# EAGLE design prot-atmel-rev8(Display_PowerTip) (EAGLE 6.2)
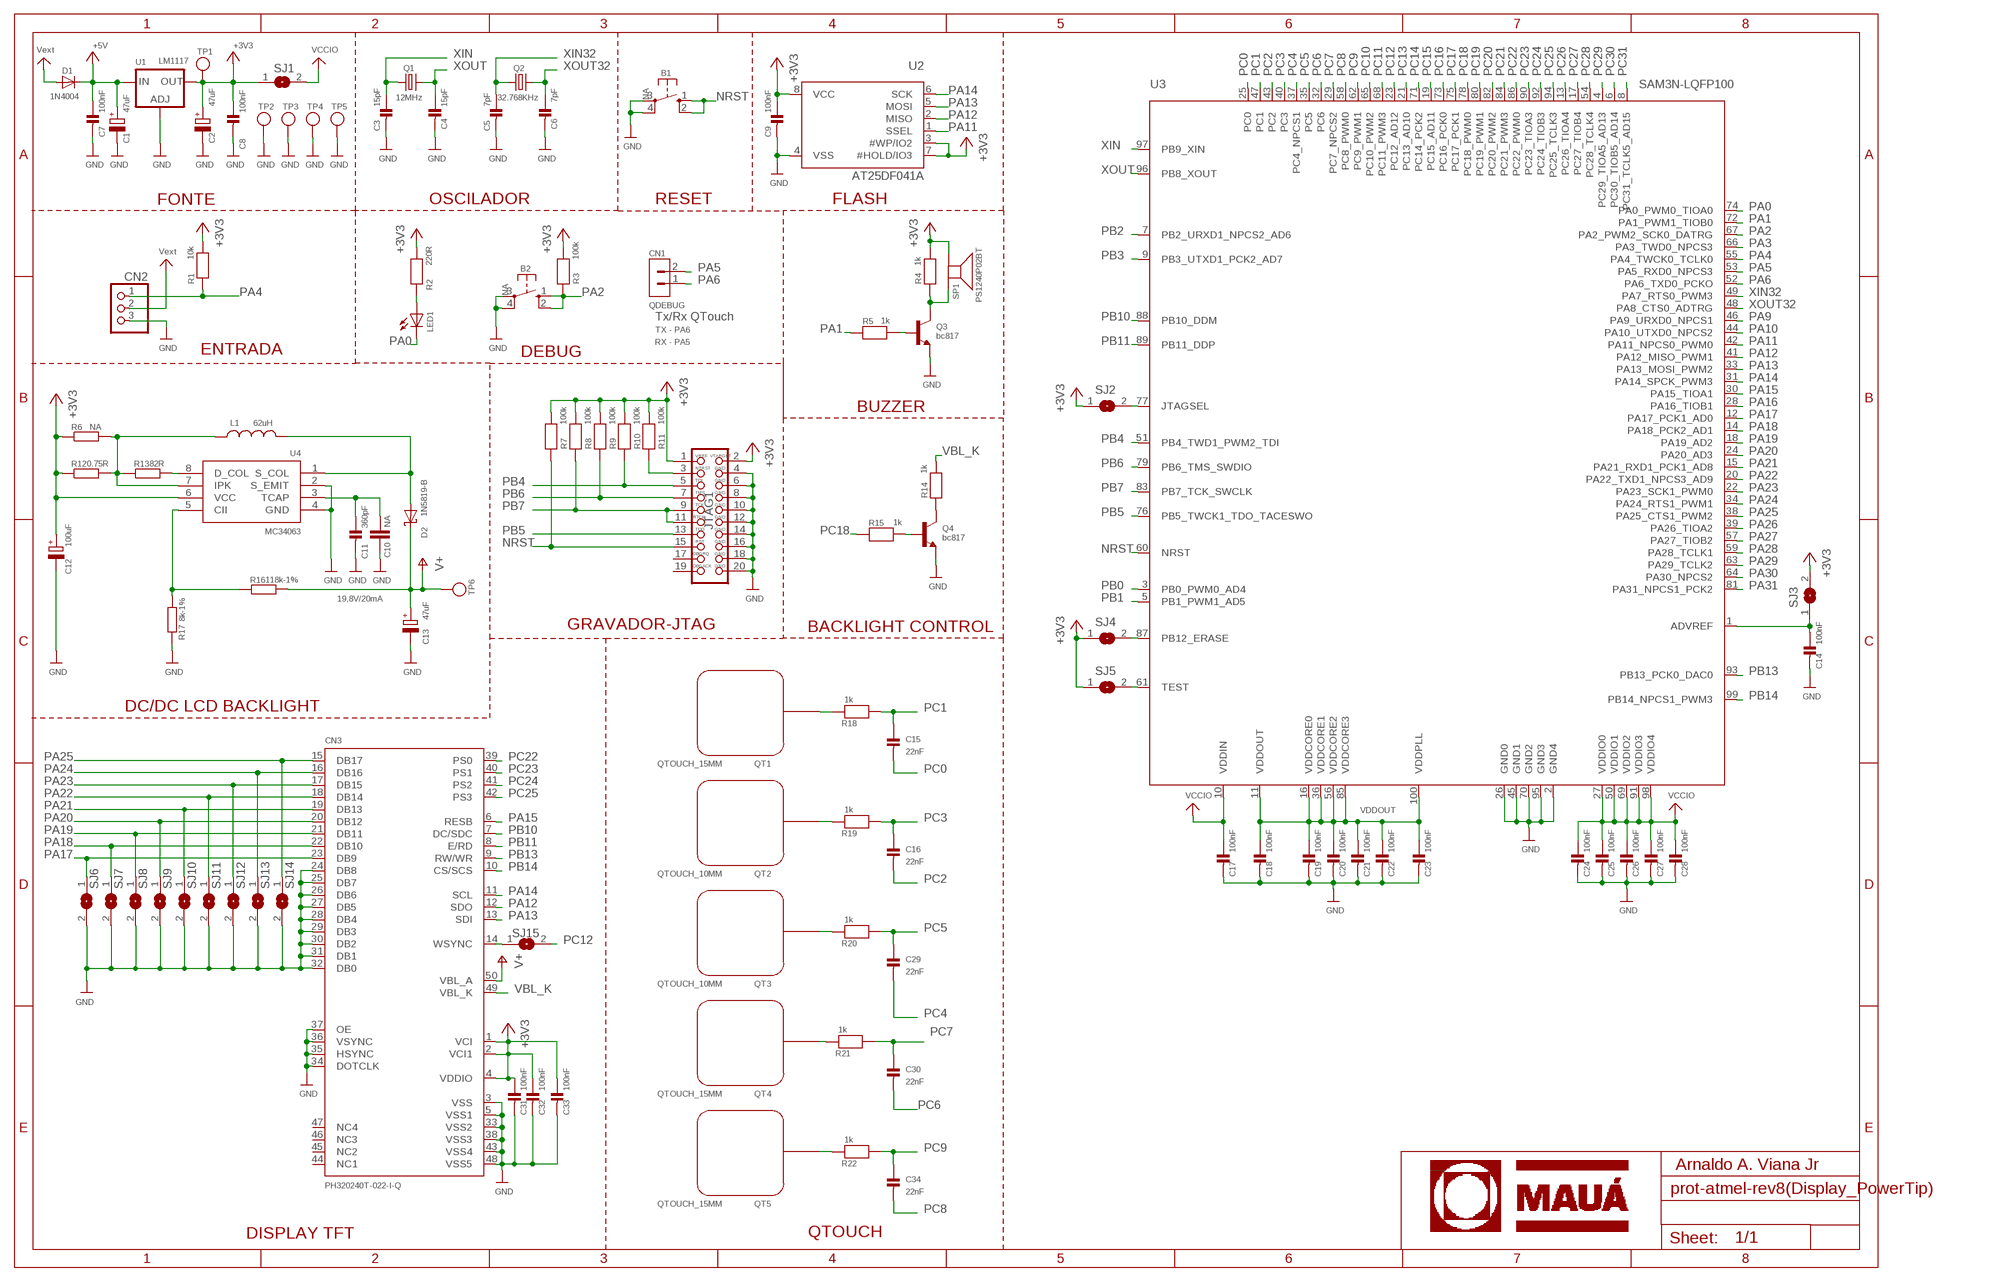
[diagram p0: schematic, sheet 1]

## Parts
B1  NA  10-XX  [B3F-10XX]
B2  NA  10-XX  [B3F-10XX]
C1  47uF  CPOL-EUE2.5-6  [E2,5-6]
C2  47uF  CPOL-EUE2.5-6  [E2,5-6]
C3  15pF  CAP_CERAMIC0805  [0805]
C4  15pF  CAP_CERAMIC0805  [0805]
C5  7pF  CAP_CERAMIC0805  [0805]
C6  7pF  CAP_CERAMIC0805  [0805]
C7  100nF  CAP_CERAMIC0805  [0805]
C8  100nF  CAP_CERAMIC0805  [0805]
C9  100nF  CAP_CERAMIC0805  [0805]
C10  NA  C-EU025-025X050  [C025-025X050]
C11  360pF  CAP_CERAMIC0805  [0805]
C12  100uF  CPOL-EUE2.5-6  [E2,5-6]
C13  47uF  CPOL-EUE2.5-6  [E2,5-6]
C14  100nF  CAP_CERAMIC0805  [0805]
C15  22nF  CAP_CERAMIC0805  [0805]
C16  22nF  CAP_CERAMIC0805  [0805]
C17  100nF  CAP_CERAMIC0805  [0805]
C18  100nF  CAP_CERAMIC0805  [0805]
C19  100nF  CAP_CERAMIC0805  [0805]
C20  100nF  CAP_CERAMIC0805  [0805]
C21  100nF  CAP_CERAMIC0805  [0805]
C22  100nF  CAP_CERAMIC0805  [0805]
C23  100nF  CAP_CERAMIC0805  [0805]
C24  100nF  CAP_CERAMIC0805  [0805]
C25  100nF  CAP_CERAMIC0805  [0805]
C26  100nF  CAP_CERAMIC0805  [0805]
C27  100nF  CAP_CERAMIC0805  [0805]
C28  100nF  CAP_CERAMIC0805  [0805]
C29  22nF  CAP_CERAMIC0805  [0805]
C30  22nF  CAP_CERAMIC0805  [0805]
C31  100nF  CAP_CERAMIC0805  [0805]
C32  100nF  CAP_CERAMIC0805  [0805]
C33  100nF  CAP_CERAMIC0805  [0805]
C34  22nF  CAP_CERAMIC0805  [0805]
CN1  QDEBUG  HEADER_1X02  [HEADER_1X02]
CN2  HEADER-1X3  [1X03_OVAL]
CN3  PH320240T-022-I-Q  DISP_TFT_PH320240T-022-I-QTOP  [FPC50PIN_TFT-PH320240T]
D1  1N4004  DIODE-D-5  [D-5]
D2  1N5819-B  [DO41-7.6]
JTAG1  JTAG-ARM  [JTAG-ARM]
L1  62uH  L-US0204/5  [0204/5]
LED1  LEDSML0805  [SML0805]
Q1  12MHz  CRYSTALHC49S  [HC49/S]
Q2  32.768KHz  CRYSTALTC26V  [TC26V]
Q3  bc817  TRANSISTOR_NPNWAVE  [SOT23-W]
Q4  bc817  TRANSISTOR_NPNWAVE  [SOT23-W]
QT1  QTOUCH_15MM  [BUTTON_15MM]
QT2  QTOUCH_10MM  [BUTTON_10MM]
QT3  QTOUCH_10MM  [BUTTON_10MM]
QT4  QTOUCH_15MM  [BUTTON_15MM]
QT5  QTOUCH_15MM  [BUTTON_15MM]
R1  10k  RESISTOR_0805  [_0805]
R2  220R  RESISTOR_0805  [_0805]
R3  100k  RESISTOR_0805  [_0805]
R4  1k  RESISTOR_0805  [_0805]
R5  1k  RESISTOR_0805  [_0805]
R6  NA  R-EU_0204/5  [0204/5]
R7  100k  RESISTOR_0805  [_0805]
R8  100k  RESISTOR_0805  [_0805]
R9  100k  RESISTOR_0805  [_0805]
R10  100k  RESISTOR_0805  [_0805]
R11  100k  RESISTOR_0805  [_0805]
R12  0.75R  R-EU_R1218  [R1218]
R13  82R  R-EU_M0805  [M0805]
R14  1k  RESISTOR_0805  [_0805]
R15  1k  RESISTOR_0805  [_0805]
R16  118k-1%  R-EU_M0805  [M0805]
R17  8k-1%  R-EU_M0805  [M0805]
R18  1k  RESISTOR_0805  [_0805]
R19  1k  RESISTOR_0805  [_0805]
R20  1k  RESISTOR_0805  [_0805]
R21  1k  RESISTOR_0805  [_0805]
R22  1k  RESISTOR_0805  [_0805]
SJ1  SOLDERJUMPER  [SOLDERJUMPER_ARROW_NOPASTE]
SJ2  SOLDERJUMPER  [SOLDERJUMPER_ARROW_NOPASTE]
SJ3  SOLDERJUMPER  [SOLDERJUMPER_ARROW_NOPASTE]
SJ4  SOLDERJUMPER  [SOLDERJUMPER_ARROW_NOPASTE]
SJ5  SOLDERJUMPER  [SOLDERJUMPER_ARROW_NOPASTE]
SJ6  SOLDERJUMPER  [SOLDERJUMPER_ARROW_NOPASTE]
SJ7  SOLDERJUMPER  [SOLDERJUMPER_ARROW_NOPASTE]
SJ8  SOLDERJUMPER  [SOLDERJUMPER_ARROW_NOPASTE]
SJ9  SOLDERJUMPER  [SOLDERJUMPER_ARROW_NOPASTE]
SJ10  SOLDERJUMPER  [SOLDERJUMPER_ARROW_NOPASTE]
SJ11  SOLDERJUMPER  [SOLDERJUMPER_ARROW_NOPASTE]
SJ12  SOLDERJUMPER  [SOLDERJUMPER_ARROW_NOPASTE]
SJ13  SOLDERJUMPER  [SOLDERJUMPER_ARROW_NOPASTE]
SJ14  SOLDERJUMPER  [SOLDERJUMPER_ARROW_NOPASTE]
SJ15  SOLDERJUMPER  [SOLDERJUMPER_ARROW_NOPASTE]
SP1  PS1240P02BT  [PS1240P02BT]
TP1  +3V3  TESTPOINT0.1"  [1X01_ROUND]
TP2  GND  TESTPOINT0.1"  [1X01_ROUND]
TP3  GND  TESTPOINT0.1"  [1X01_ROUND]
TP4  GND  TESTPOINT0.1"  [1X01_ROUND]
TP5  GND  TESTPOINT0.1"  [1X01_ROUND]
TP6  +V  TESTPOINT0.1"  [1X01_ROUND]
U1  LM1117  LM1117TO252  [TO252]
U2  AT25DF041A  SPIFLASH_SOIC8208MIL  [SOIC8_208MIL]
U3  SAM3N-LQFP100  [LQFP100]
U4  MC34063  MC34063A  [SOIC8_150MIL]

## Nets
12V: CN2.2 D1.A ; supply symbol labelled Vext
+3V3: C2.+ C8.1 C9.1 C12.+ C31.1 C32.1 C33.1 CN3.1(VCI) CN3.2(VCI1) CN3.4(VDDIO) JTAG1.1 JTAG1.2 R1.2 R2.2 R3.2 R4.2 R6.1 R7.2 R8.2 R9.2 R10.2 R11.2 R12.1 SJ1.1 SJ2.1 SJ3.2 SJ4.1 SJ5.1 SP1.P$2 TP1.1 U1.3(OUT) U2.3(#WP/IO2) U2.7(#HOLD/IO3) U2.8(VCC) U4.6(VCC)
+5V: C1.+ C7.1 D1.C U1.2(IN)
ADVREF: C14.1 SJ3.1 U3.1(ADVREF)
GND: B1.3(P) B1.4(P1) B2.3(P) B2.4(P1) C1.- C2.- C3.2 C4.2 C5.2 C6.2 C7.2 C8.2 C9.2 C10.2 C11.2 C12.- C13.- C14.2 C17.2 C18.2 C19.2 C20.2 C21.2 C22.2 C23.2 C24.2 C25.2 C26.2 C27.2 C28.2 C31.2 C32.2 C33.2 CN2.3 CN3.3(VSS) CN3.5(VSS1) CN3.24(DB8) CN3.25(DB7) CN3.26(DB6) CN3.27(DB5) CN3.28(DB4) CN3.29(DB3) CN3.30(DB2) CN3.31(DB1) CN3.32(DB0) CN3.33(VSS2) CN3.34(DOTCLK) CN3.35(HSYNC) CN3.36(VSYNC) CN3.37(OE) CN3.38(VSS3) CN3.43(VSS4) CN3.48(VSS5) JTAG1.4 JTAG1.6 JTAG1.8 JTAG1.10 JTAG1.12 JTAG1.14 JTAG1.16 JTAG1.18 JTAG1.20 Q3.2(E) Q4.2(E) R17.1 SJ6.2 SJ7.2 SJ8.2 SJ9.2 SJ10.2 SJ11.2 SJ12.2 SJ13.2 SJ14.2 TP2.1 TP3.1 TP4.1 TP5.1 U1.1(ADJ) U2.4(VSS) U3.2(GND4) U3.26(GND0) U3.45(GND1) U3.70(GND2) U3.95(GND3) U4.2(S_EMIT) U4.4(GND)
N$1: Q4.1(B) R15.2
N$2: Q4.3(C) R14.1
N$3: SJ2.2 U3.77(JTAGSEL)
N$4: CN3.14(WSYNC) SJ15.1
N$7: JTAG1.3 R11.1
N$8: QT2.P$1 R19.2
N$10: QT3.P$1 R20.2
N$12: QT4.P$1 R21.2
N$14: LED1.A R2.1
N$16: QT5.P$1 R22.2
N$22: SJ4.2 U3.87(PB12_ERASE)
N$26: Q3.1(B) R5.1
N$27: Q3.3(C) R4.1 SP1.P$1
N$30: SJ5.2 U3.61(TEST)
N$49: R13.2 U4.8(D_COL)
N$50: L1.1 R6.2 R12.2 R13.1 U4.7(IPK)
N$51: R16.1 R17.2 U4.5(CII)
N$52: D2.A L1.2 U4.1(S_COL)
N$53: C10.1 C11.1 U4.3(TCAP)
N$59: QT1.P$1 R18.2
NRST: B1.1(S) B1.2(S1) JTAG1.15 R7.1 U3.60(NRST)
PA0: LED1.C U3.74(PA0_PWM0_TIOA0)
PA1: R5.2 U3.72(PA1_PWM1_TIOB0)
PA2: B2.1(S) B2.2(S1) R3.1 U3.67(PA2_PWM2_SCK0_DATRG)
PA3: U3.66(PA3_TWD0_NPCS3)
PA4: CN2.1 R1.1 U3.55(PA4_TWCK0_TCLK0)
PA5: CN1.2 U3.53(PA5_RXD0_NPCS3)
PA6: CN1.1 U3.52(PA6_TXD0_PCKO)
PA9: U3.46(PA9_URXD0_NPCS1)
PA10: U3.44(PA10_UTXD0_NPCS2)
PA11: U2.1(SSEL) U3.42(PA11_NPCS0_PWM0)
PA12: CN3.12(SDO) U2.2(MISO) U3.41(PA12_MISO_PWM1)
PA13: CN3.13(SDI) U2.5(MOSI) U3.33(PA13_MOSI_PWM2)
PA14: CN3.11(SCL) U2.6(SCK) U3.31(PA14_SPCK_PWM3)
PA15: CN3.6(RESB) U3.30(PA15_TIOA1)
PA16: U3.28(PA16_TIOB1)
PA17: CN3.23(DB9) SJ6.1 U3.12(PA17_PCK1_AD0)
PA18: CN3.22(DB10) SJ7.1 U3.14(PA18_PCK2_AD1)
PA19: CN3.21(DB11) SJ8.1 U3.18(PA19_AD2)
PA20: CN3.20(DB12) SJ9.1 U3.24(PA20_AD3)
PA21: CN3.19(DB13) SJ10.1 U3.15(PA21_RXD1_PCK1_AD8)
PA22: CN3.18(DB14) SJ11.1 U3.20(PA22_TXD1_NPCS3_AD9)
PA23: CN3.17(DB15) SJ12.1 U3.22(PA23_SCK1_PWM0)
PA24: CN3.16(DB16) SJ13.1 U3.34(PA24_RTS1_PWM1)
PA25: CN3.15(DB17) SJ14.1 U3.38(PA25_CTS1_PWM2)
PA26: U3.39(PA26_TIOA2)
PA27: U3.57(PA27_TIOB2)
PA28: U3.59(PA28_TCLK1)
PA29: U3.63(PA29_TCLK2)
PA30: U3.64(PA30_NPCS2)
PA31: U3.81(PA31_NPCS1_PCK2)
PB0: U3.3(PB0_PWM0_AD4)
PB1: U3.5(PB1_PWM1_AD5)
PB2: U3.7(PB2_URXD1_NPCS2_AD6)
PB3: U3.9(PB3_UTXD1_PCK2_AD7)
PB4: JTAG1.5 R10.1 U3.51(PB4_TWD1_PWM2_TDI)
PB5: JTAG1.13 U3.76(PB5_TWCK1_TDO_TACESWO)
PB6: JTAG1.7 R9.1 U3.79(PB6_TMS_SWDIO)
PB7: JTAG1.9 JTAG1.11 R8.1 U3.83(PB7_TCK_SWCLK)
PB10: CN3.7(DC/SDC) U3.88(PB10_DDM)
PB11: CN3.8(E/RD) U3.89(PB11_DDP)
PB13: CN3.9(RW/WR) U3.93(PB13_PCK0_DAC0)
PB14: CN3.10(CS/SCS) U3.99(PB14_NPCS1_PWM3)
PC0: C15.2 U3.25(PC0)
PC1: C15.1 R18.1 U3.47(PC1)
PC2: C16.2 U3.43(PC2)
PC3: C16.1 R19.1 U3.40(PC3)
PC4: C29.2 U3.37(PC4_NPCS1)
PC5: C29.1 R20.1 U3.35(PC5)
PC6: C30.2 U3.32(PC6)
PC7: C30.1 R21.1 U3.29(PC7_NPCS2)
PC8: C34.2 U3.58(PC8_PWM0)
PC9: C34.1 R22.1 U3.62(PC9_PWM1)
PC10: U3.65(PC10_PWM2)
PC11: U3.68(PC11_PWM3)
PC12: SJ15.2 U3.23(PC12_AD12)
PC13: U3.21(PC13_AD10)
PC14: U3.71(PC14_PCK2)
PC15: U3.19(PC15_AD11)
PC16: U3.73(PC16_PCK0)
PC17: U3.75(PC17_PCK1)
PC18: R15.1 U3.78(PC18_PWM0)
PC19: U3.80(PC19_PWM1)
PC20: U3.82(PC20_PWM2)
PC21: U3.84(PC21_PWM3)
PC22: CN3.39(PS0) U3.86(PC22_PWM0)
PC23: CN3.40(PS1) U3.90(PC23_TIOA3)
PC24: CN3.41(PS2) U3.92(PC24_TIOB3)
PC25: CN3.42(PS3) U3.94(PC25_TCLK3)
PC26: U3.13(PC26_TIOA4)
PC27: U3.17(PC27_TIOB4)
PC28: U3.54(PC28_TCLK4)
PC29: U3.4(PC29_TIOA5_AD13)
PC30: U3.6(PC30_TIOB5_AD14)
PC31: U3.8(PC31_TCLK5_AD15)
V+: C13.+ CN3.50(VBL_A) D2.C R16.2 TP6.1
VBL_K: CN3.49(VBL_K) R14.2
VCCIO: C17.1 C24.1 C25.1 C26.1 C27.1 C28.1 SJ1.2 U3.10(VDDIN) U3.27(VDDIO0) U3.50(VDDIO1) U3.69(VDDIO2) U3.91(VDDIO3) U3.98(VDDIO4)
VDDOUT: C18.1 C19.1 C20.1 C21.1 C22.1 C23.1 U3.11(VDDOUT) U3.16(VDDCORE0) U3.36(VDDCORE1) U3.56(VDDCORE2) U3.85(VDDCORE3) U3.100(VDDPLL)
XIN: C3.1 Q1.1 U3.97(PB9_XIN)
XIN32: C5.1 Q2.1 U3.49(PA7_RTS0_PWM3)
XOUT: C4.1 Q1.2 U3.96(PB8_XOUT)
XOUT32: C6.1 Q2.2 U3.48(PA8_CTS0_ADTRG)
Unconnected: CN3.44(NC1) CN3.45(NC2) CN3.46(NC3) CN3.47(NC4) JTAG1.17 JTAG1.19

## Notes on the sheet
- FONTE | OSCILADOR | RESET | FLASH
- Tx/Rx QTouch
- TX - PA6
- RX - PA5
- ENTRADA | DEBUG
- BUZZER
- 19,8V/20mA
- GRAVADOR-JTAG | BACKLIGHT CONTROL
- DC/DC LCD BACKLIGHT
- Arnaldo A. Viana Jr
- DISPLAY TFT | QTOUCH

## Library data of the parts
B1 B2 = switch-omron:10-XX: OMRON SWITCH; EAGLEUP: B3F-10xx; MPN: B3F-1000; OC_FARNELL: 176432; OC_NEWARK: 36M3542
C1 C2 C12 C13 = rcl:CPOL-EU: POLARIZED CAPACITOR, European symbol; EAGLEUP: E5-6
C3-C9 C11 C14-C34 = junior:CAP_CERAMIC: Ceramic Capacitors 0402 - 0402 Surface Mount Capacitors 16pF 50V 5% [Digikey: 445-4899-2-ND] 18pF 50V 5% [Digikey: 490-1281-2-ND] 22pF 50V 5% [Digikey: 490-1283-2-ND] 68pF 50V 5% [Digikey: 490-1289-2-ND] 0.1uF 10V 10% [Digikey: 490-1318-2-ND] 1.0uF 6.3V 10% [Digikey: 490-1320-2-ND] 0603 - 0603 Surface Mount Capacitors 16 pF 50V 5% [Digikey: 445-5051-2-ND] 22 pF 50V [Digikey: PCC220ACVTR-ND] 33 pF 50V 5% [Digikey: 490-1415-1-ND] 56pF 50V 5% [Digikey: 490-1421-1-ND] 220pF 50V 5% [Digikey: 445-1285-1-ND] 680 pF 50V 2200 pF 50V 5% C0G [Digikey: 445-1297-1-ND] 5600 pF 100V 5% X7R [Digikey: 478-3711-1-ND] 0.1 µF 25V 10% [Digikey: PCC2277TR-ND] 0.22 µF 16V 10% X7R [Digikey: 445-1318-1-ND] 1.0 µF 25V 10% [Digikey: 445-5146-2-ND] 0603 - RF Specific 3pF 250V +/-0.1pF RF [Digikey: 712-1347-1-ND] 18 pF 250V 5% [Digikey: 478-3505-1-ND or 712-1322-1-ND] 56 pF 250V 5% C0G RF [Digikey: 490-4867-1-ND] 68 pF 250V RF [Digikey: 490-4868-1-ND] 0805 - 0805 Surface Mount Capacitors 220 pF 250V 2% RF Ceramic Capacitor [Digikey: 712-1398-1-ND] 1000 pF 50V 2% NP0 Ceramic Capacitor [Digikey: 478-3760-1-ND] 0.1 µF 25V 10% Ceramic Capacitor [Digikey: PCC1828TR-ND] 1.0 µF 16V 10% Ceramic Capacitor[Digikey: 490-1691-2-ND] 10.0 µF 10V 10% Ceramic Capacitor[Digikey: 709-1228-1-ND] 10.0 uF 16V 10% Ceramic Capacitor [Digikey: 478-5165-2-ND] 47 uF 6.3V 20% Ceramic Capacitor [Digikey: 587-1779-1-ND or 399-5506-1-ND] 1206 - 1206 Surface Mount Capacitors 47uF 10V 20% Ceramic Capacitor [Digikey: 490-5528-1-ND or 399-5508-1-ND or 445-6010-1-ND] 100uF 6.3V -20%, +80% Y5V Ceramic Capacitor (Digikey: 490-4512-1-ND, Mouser: 81-GRM31CF50J107ZE1L); EAGLEUP: C0805
C10 = rcl:C-EU: CAPACITOR, European symbol
CN1 = junior:HEADER_1X02: 2-Pin 0,254cm / 0.1" Header
CN2 = junior:HEADER-1X3: PIN HEADER
CN3 = junior:DISP_TFT_PH320240T-022-I-Q: DISPLAY TFT 320X240 POWERTIP PH320240T-022-I-Q Power Supply Voltage: 3v3 Backlight: 19,8V/20mA
D1 = diode:DIODE-: DIODE; EAGLEUP: DO41-10
D2 = diode:1N581*: 1.0A SCHOTTKY BARRIER RECTIFIER Source: http://www.diodes.com/datasheets/ds23001.pdf; EAGLEUP: DO41-10
JTAG1 = junior:JTAG-ARM: 20 Pin JTAG Connector For use with ARM7, and ARM9. Supported by some Cortex M3 boards with SWJ-DP interfaces (dual SWP/JTAG support). 4UConnector: 03556; EAGLEUP: ML20
L1 = rcl:L-US: INDUCTOR, American symbol
LED1 = led:LED: LED OSRAM: - CHIPLED LG R971, LG N971, LY N971, LG Q971, LY Q971, LO R971, LY R971 LH N974, LH R974 LS Q976, LO Q976, LY Q976 LO Q996 - Hyper CHIPLED LW Q18S LB Q993, LB Q99A, LB R99A - SideLED LS A670, LO A670, LY A670, LG A670, LP A670 LB A673, LV A673, LT A673, LW A673 LH A674 LY A675 LS A676, LA A676, LO A676, LY A676, LW A676 LS A679, LY A679, LG A679 - Hyper Micro SIDELED® LS Y876, LA Y876, LO Y876, LY Y876 LT Y87S - SmartLED LW L88C, LW L88S LB L89C, LB L89S, LG L890 LS L89K, LO L89K, LY L89K LS L896, LA L896, LO L896, LY L896 - TOPLED LS T670, LO T670, LY T670, LG T670, LP T670 LSG T670, LSP T670, LSY T670, LOP T670, LYG T670 LG T671, LOG T671, LSG T671 LB T673, LV T673, LT T673, LW T673 LH T674 LS T676, LA T676, LO T676, LY T676, LB T676, LH T676, LSB T676, LW T676 LB T67C, LV T67C, LT T67C, LS T67K, LO T67K, LY T67K, LW E67C LS E67B, LA E67B, LO E67B, LY E67B, LB E67C, LV E67C, LT E67C LW T67C LS T679, LY T679, LG T679 LS T770, LO T770, LY T770, LG T770, LP T770 LB T773, LV T773, LT T773, LW T773 LH T774 LS E675, LA E675, LY E675, LS T675 LS T776, LA T776, LO T776, LY T776, LB T776 LHGB T686 LT T68C, LB T68C - Hyper Mini TOPLED® LB M676 - Mini TOPLED Santana® LG M470 LS M47K, LO M47K, LY M47K Source: http://www.osram.convergy.de LUXEON: - LUMILED® LXK2-PW12-R00, LXK2-PW12-S00, LXK2-PW14-U00, LXK2-PW14-V00 LXK2-PM12-R00, LXK2-PM12-S00, LXK2-PM14-U00 LXK2-PE12-Q00, LXK2-PE12-R00, LXK2-PE12-S00, LXK2-PE14-T00, LXK2-PE14-U00 LXK2-PB12-K00, LXK2-PB12-L00, LXK2-PB12-M00, LXK2-PB14-N00, LXK2-PB14-P00, LXK2-PB14-Q00 LXK2-PR12-L00, LXK2-PR12-M00, LXK2-PR14-Q00, LXK2-PR14-R00 LXK2-PD12-Q00, LXK2-PD12-R00, LXK2-PD12-S00 LXK2-PH12-R00, LXK2-PH12-S00 LXK2-PL12-P00, LXK2-PL12-Q00, LXK2-PL12-R00 Source: www.luxeon.com KINGBRIGHT: KA-3528ASYC Source: www.kingbright.com
Q1 = crystal:CRYSTAL: CRYSTAL; EAGLEUP: HC49U70; OC_FARNELL: 1667008; OC_NEWARK: unknown
Q2 = crystal:CRYSTAL: CRYSTAL; EAGLEUP: TC38H; OC_FARNELL: unknown; OC_NEWARK: unknown
Q3 Q4 = junior:TRANSISTOR_NPN: NPN Transistor Transistor (NPN) 500mA 45V - BC817 [Digikey: 568-1631-1-ND] Transistor (NPN) 500mA 45V - BC817,215 [Mouser: 771-BC817-T/R] SOT23-R - SOT23 footprint optimised for use with solder paste and reflow ovens. SOT23-W - SOT23 footprint optimised for hand-soldering (larger pads).; EAGLEUP: SOT23
QT1 QT4 QT5 = QTOUCH:QTOUCH_15MM
QT2 QT3 = QTOUCH:QTOUCH_10MM
R1-R5 R7-R11 R14 R15 R18-R22 = junior:RESISTOR: Resistors 0402 - 0402 Surface Mount Package 22 Ohm 1% 1/16W [Digikey: 311-22.0LRTR-ND] 33 Ohm 5% 1/16W 1.0K 5% 1/16W 1.5K 5% 1/16W 2.0K 1% 1/16W 10.0K 1% 1/16W [Digikey: 311-10.0KLRTR-ND] 10.0K 5% 1/16W [Digikey: RMCF0402JT10K0TR-ND] 12.1K 1% 1/16W [Digikey: 311-22.0LRTR-ND] 100.0K 5% 1/16W 0603 - 0603 Surface Mount Package 0 Ohm 1/10 Watt 1% Resistor 15 Ohm 1/10 Watt 1% Resistor 33 Ohm 1/10 Watt 1% Resistor 49.9 Ohm 1/10 Watt 1% Resistor 100 Ohm 1/10 Watt 1% Resistor 150 Ohm 1/10 Watt 1% Resistor 240 Ohm 1/10 Watt 1% Resistor 390 Ohm 1/10 Watt 1% Resistor 560 Ohm 1/10 Watt 1% Resistor 680 Ohm 1/10 Watt 1% Resistor 750 Ohm 1/10 Watt 1% Resistor 1.0K Ohm 1/10 Watt 1% Resistor 1.5K Ohm 1/10 Watt 1% Resistor 2.0K Ohm 1/10 Watt 1% Resistor 2.2K Ohm 1/10 Watt 1% Resistor 3.3K Ohm 1/10 Watt 1% Resistor 4.7K Ohm 1/10 Watt 1% Resistor 10.0K Ohm 1/10 Watt 1% Resistor 12.0K Ohm 1/10 Watt 1% Resistor 12.1K Ohm 1/10 Watt 1% Resistor 20.0K Ohm 1/10 Watt 1% Resistor 33.0K Ohm 1/10 Watt 1% Resistor 100.0K Ohm 1/10 Watt 1% Resistor 0805 - 0805 Surface Mount Package 0 Ohm 1/8 Watt 1% Resistor 33 Ohm 1/8 Watt 1% Resistor 100 Ohm 1/8 Watt 1% Resistor 150 Ohm 1/8 Watt 1% Resistor 200 Ohm 1/8 Watt 1% Resistor 240 Ohm 1/8 Watt 1% Resistor 330 Ohm 1/8 Watt 1% Resistor 390 Ohm 1/8 Watt 1% Resistor 470 Ohm 1/8 Watt 1% Resistor 1.0K Ohm 1/8 Watt 1% Resistor 1.5K Ohm 1/8 Watt 1% Resistor 2.0K Ohm 1/8 Watt 1% Resistor 4.7K Ohm 1/8 Watt 1% Resistor 5.1K Ohm 1/8 Watt 1% Resistor 5.6K Ohm 1/8 Watt 1% Resistor 10.0K Ohm 1/8 Watt 1% Resistor 22.0K Ohm 1/8 Watt 1% Resistor 33.0K Ohm 1/8 Watt 1% Resistor 100K Ohm 1/8 Watt 1% Resistor 1206 - 1206 Surface Mount Package 2012 - 2010 Surface Mount Package 0.11 Ohm 1/2 Watt 1% Resistor - Digikey: RHM.11UCT-ND; EAGLEUP: R0805
R6 = rcl:R-EU_: RESISTOR, European symbol
R12 = rcl:R-EU_: RESISTOR, European symbol; EAGLEUP: R1206
R13 R16 R17 = rcl:R-EU_: RESISTOR, European symbol; EAGLEUP: R0805
SJ1-SJ15 = junior:SOLDERJUMPER: SMD Solder JUMPER Solder the two pads together to create a connection, or remove the solder to break it. REFLOW - Use this footprint for solder paste and reflow ovens. WAVE - Use this footprint for hand-soldering (larger pads). CLOSED - Has a trace between the two pads to ensure it is closed by default. The trace needs to be cut to disable the jumper, and can be closed again by creating a solder bridge between the two pads.; BOM: EXCLUDE
SP1 = junior:PS1240P02BT; EAGLEUP: buzzer
TP1-TP6 = junior:TESTPOINT: Test Point Various test points for characterisation and PCB testing TESTPOINT_SMT - Compact Surface Mount Test Point [Digikey: 5016KTR-ND]; BOM: EXCLUDE
U1 = junior:LM1117: LM1117 Voltage Regulator LM1117 Adjustable Voltage regulator [Digikey: LM1117IMP-ADJDKR-ND] LM1117 3.3V Voltage regulator [AP1117E33GDIDKR-ND] LM1117 5.0V Voltage regulator [AP1117E50GDIDKR-ND] SOT223-REFLOW - SOT223 package for solder paste/reflow ovens SOT223-WAVE - SOT223 package for hand-soldering (larger pads) Note: For the fixed-voltage regulators, simply set the ADJ pin to GND.
U2 = junior:SPIFLASH_SOIC8: SOIC8 SPI Flash Be careful with the size since SOIC8 flash comes in several 'widths' SOIC8 150 mil M25P16 - 16Mbit (2Mbit x 8) Serial Flash (75MHz SPI Bus), Supply: 2.7-3.6V Digikey: SOIC8 - M25P16-VMN6P-ND SOIC8 208 mil W25Q16BVSSIG - 16Mbit (2Mbit x 8) Serial Flash (104MHz SPI Bus), Supply: 2.7-3.6V Digikey: SOIC8 - W25Q16BVSSIG-ND
U3 = junior:SAM3N-LQFP100: Atmel ARM Cortex-M3
U4 = microbuilder:MC34063A: MC34063A - 1.5A 3V-40V Boost/Buck/Inverting Voltage Regulator [Part No.] Allows you to 'boost', reduce or invert the voltage of your power supply to a more appropriate level. Common voltage regulators like the LM1117 are easy to use, but they can only 'reduce' the voltage level and require more volts than they provide, making them useless for low voltage power supplies like batteries or solar panels. A 'Step-Up' regulator like the MC34063A solves this problem by also allowing you to increase the voltage to a pre-determined level, though you still need to pay attention to the minimum voltage level the converter can handle, keeping in mind that many 'step-up' converts are less efficient at the two extreme ends of their working range. Given that many step-up circuits introduce some ripple to the power supply, you can often get a much 'smoother' supply by boosting the voltage up to 5.0V and then using a standard fixed voltage regulator (such as the common LM1117, etc.) to drop the voltage back down to 3.3V. This may not be necessary, and some step up regulators can provide a smooth supply on their own, but it's worth keeping in mind if you do encounter some ripple in the power supply using only a step-up IC for your power supply. Texas Instruments MC34063A Digikey: 296-17765-1-ND; EAGLEUP: SO08

## Board
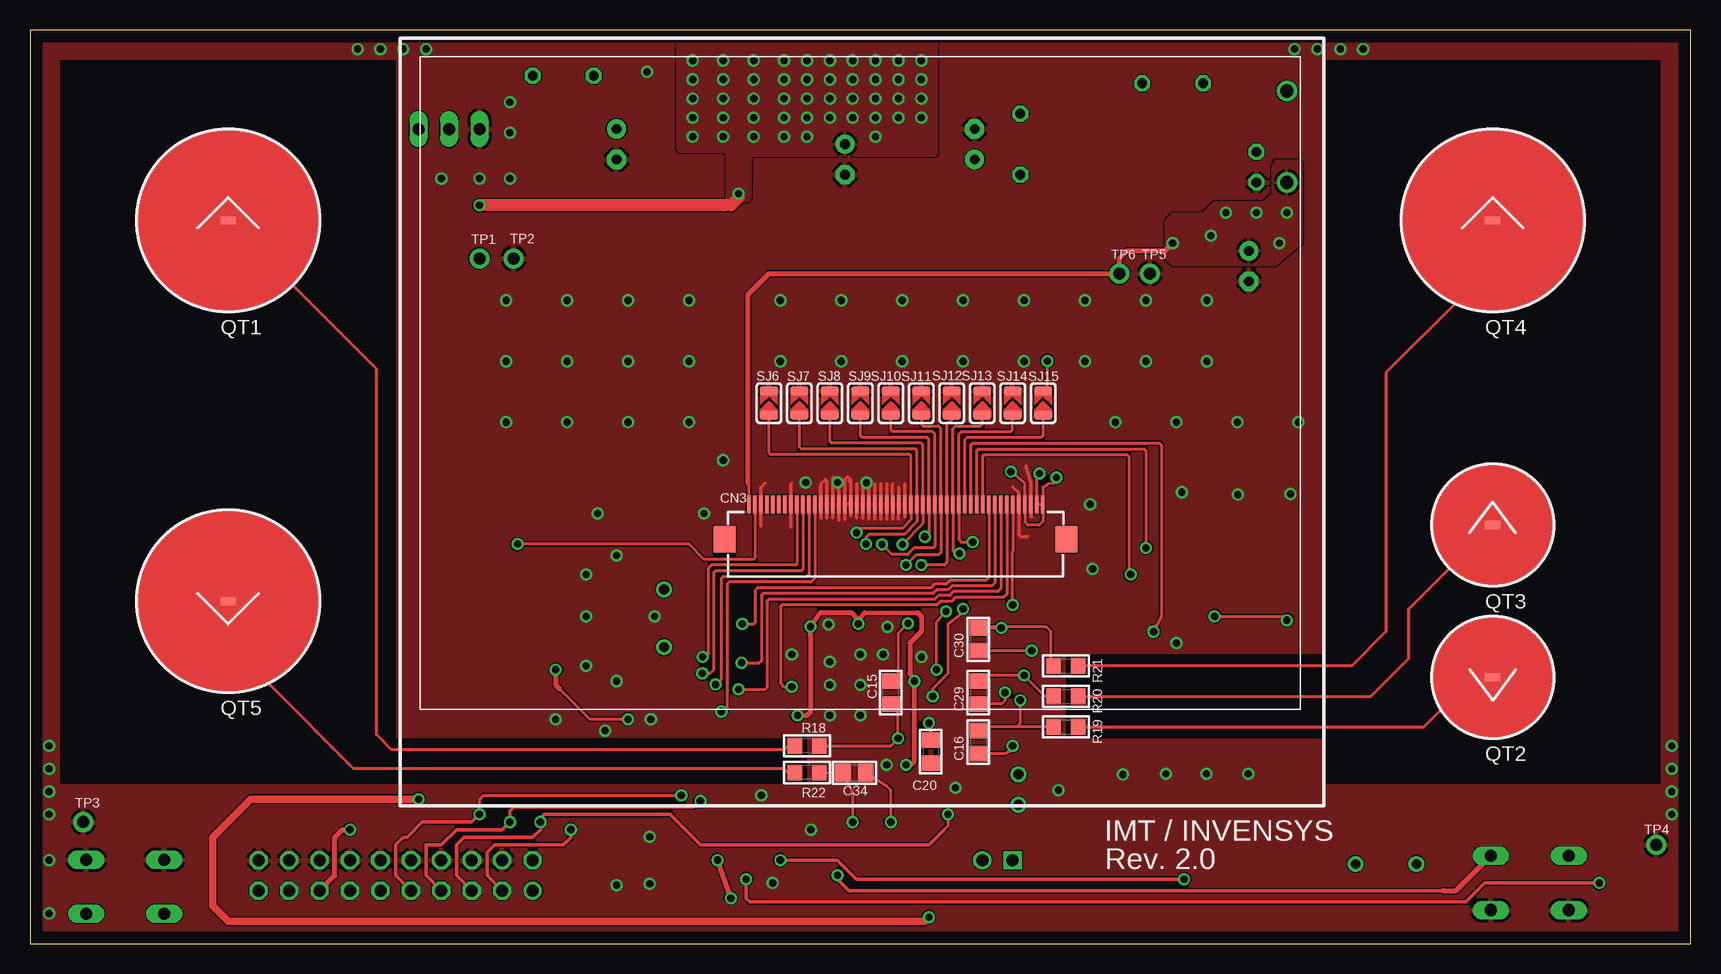
[diagram p1: board, top side]
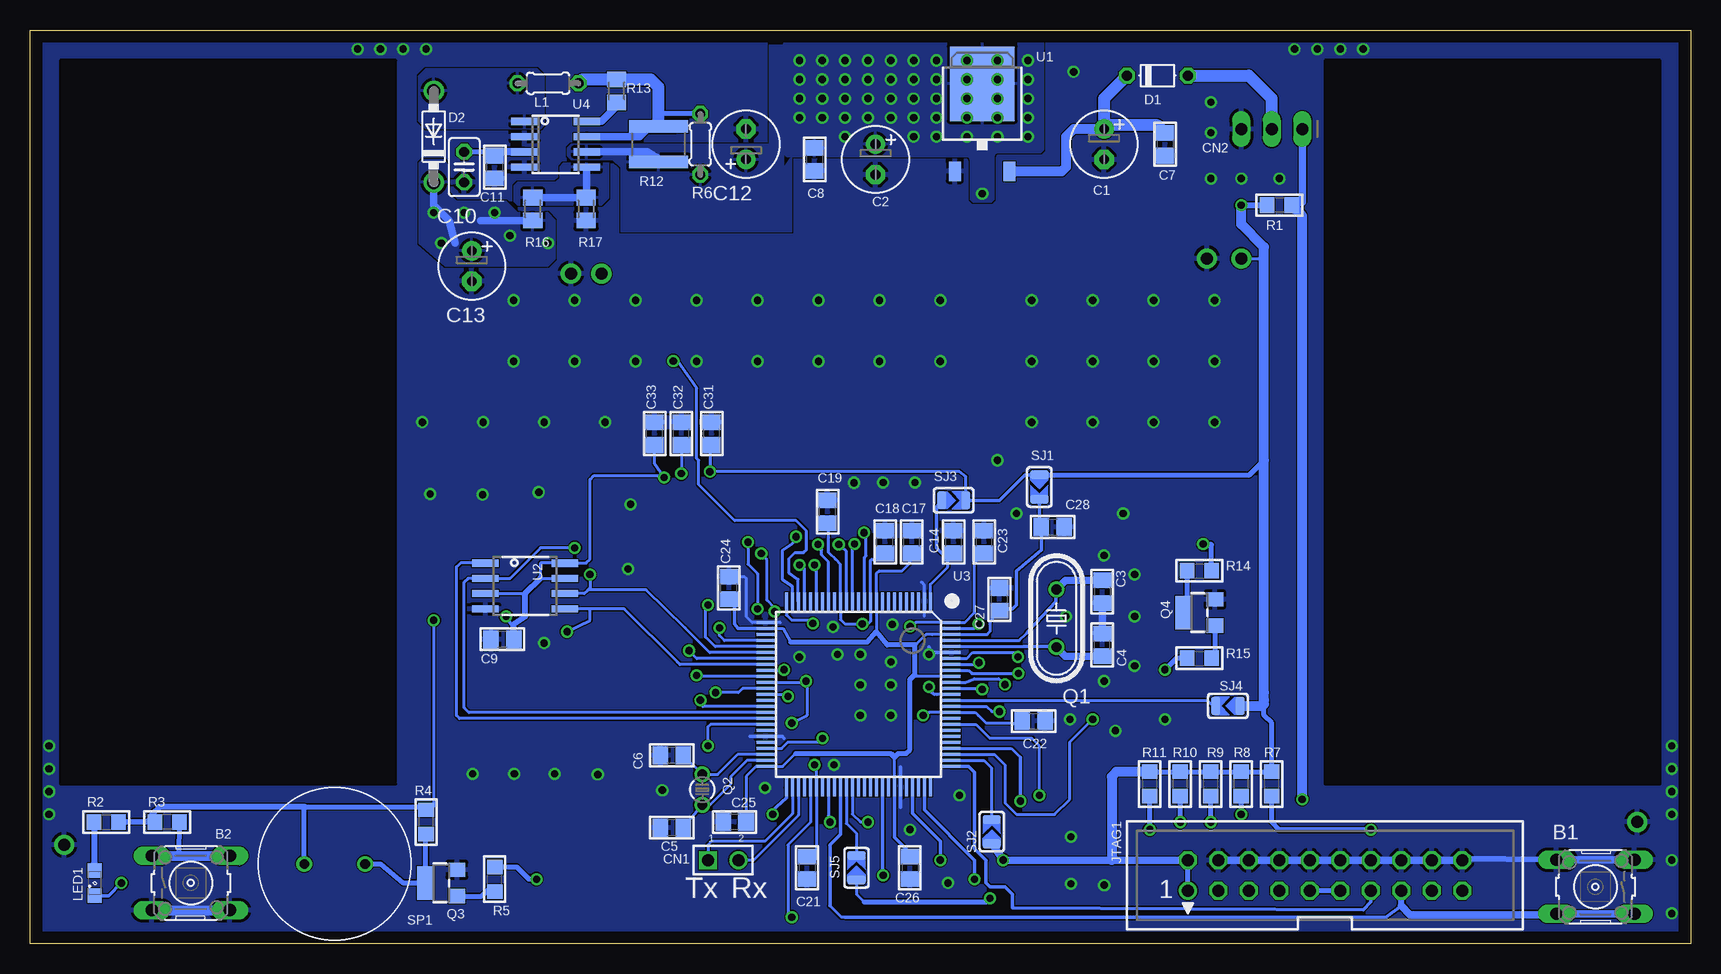
[diagram p2: board, bottom side, seen from below]

Size 138.43 x 76.2 mm. Coordinates in mm from the lower left corner, seen from the top.
Outline: 0,0 138.43,0 138.43,76.2 0,76.2 0,0
Copper layers (1*16): Top 0.035mm / dielectric 1.5mm / Bottom 0.035mm
Design rules: minimum track width 10mil, minimum drill 24mil, track to track 4mil, track to pad 8mil, pad to pad 8mil, via to via 8mil, smd to smd 8mil, copper to edge 40mil, drill to drill 8mil, minimum pad ring 10mil, minimum via ring 8mil, stop-mask expansion 4mil, vias tented up to drill 0mil, thermal gap 10mil

### Footprints (pad centres in the part's own frame; a part is rotated, then mirrored left to right if it is on the bottom)
B3F-10XX = drill 1.016 long: 1 -3.251,2.261; 2 3.251,2.261; 3 -3.251,-2.261; 4 3.251,-2.261
E2,5-6 = drill 0.813 pad 1.6: + -1.27,0 | drill 0.813 pad 1.6 octagon: - 1.27,0
0805 = smd 1.3 x 1.5: 1 -0.95,0; 2 0.95,0
C025-025X050 = drill 0.813 octagon: 1 -1.27,0; 2 1.27,0
HEADER_1X02 = drill 1 square: 1 0,0 | drill 1: 2 2.54,0
1X03_OVAL = drill 1 long: 1 -2.54,0; 2 0,0; 3 2.54,0
FPC50PIN_TFT-PH320240T = smd 0.275 x 1.5: 1 15.211,-6.846; 2 14.711,-6.846; 3 14.211,-6.846; 4 13.711,-6.846; 5 13.211,-6.846; 6 12.711,-6.846; 7 12.211,-6.846; 8 11.711,-6.846; 9 11.211,-6.846; 10 10.711,-6.846; 11 10.211,-6.846; 12 9.711,-6.846; 13 9.211,-6.846; 14 8.711,-6.846; 15 8.211,-6.846; 16 7.711,-6.846; 17 7.211,-6.846; 18 6.711,-6.846; 19 6.211,-6.846; 20 5.711,-6.846; 21 5.211,-6.846; 22 4.711,-6.846; 23 4.211,-6.846; 24 3.711,-6.846; 25 3.211,-6.846; 26 2.711,-6.846; 27 2.211,-6.846; 28 1.711,-6.846; 29 1.211,-6.846; 30 0.711,-6.846; 31 0.211,-6.846; 32 -0.289,-6.846; 33 -0.789,-6.846; 34 -1.289,-6.846; 35 -1.789,-6.846; 36 -2.289,-6.846; 37 -2.789,-6.846; 38 -3.289,-6.846; 39 -3.789,-6.846; 40 -4.289,-6.846; 41 -4.789,-6.846; 42 -5.289,-6.846; 43 -5.789,-6.846; 44 -6.289,-6.846; 45 -6.789,-6.846; 46 -7.289,-6.846; 47 -7.789,-6.846; 48 -8.289,-6.846; 49 -8.789,-6.846; 50 -9.289,-6.846 | smd 1.8 x 2.2: SUPPORT1 -11.319,-9.766; SUPPORT2 17.181,-9.766
D-5 = drill 0.813 octagon: A 2.54,0; C -2.54,0
DO41-7.6 = drill 1.1 pad 1.7: A 3.81,0; C -3.81,0
JTAG-ARM = drill 1: 1 -11.43,-1.27 | drill 1 octagon: 2 -11.43,1.27; 3 -8.89,-1.27; 4 -8.89,1.27; 5 -6.35,-1.27; 6 -6.35,1.27; 7 -3.81,-1.27; 8 -3.81,1.27; 9 -1.27,-1.27; 10 -1.27,1.27; 11 1.27,-1.27; 12 1.27,1.27; 13 3.81,-1.27; 14 3.81,1.27; 15 6.35,-1.27; 16 6.35,1.27; 17 8.89,-1.27; 18 8.89,1.27; 19 11.43,-1.27; 20 11.43,1.27
0204/5 = drill 0.813 octagon: 1 -2.54,0; 2 2.54,0
SML0805 = smd 1.2 x 1.2: A 1.05,0; C -1.05,0
HC49/S = drill 0.813: 1 -2.413,0; 2 2.413,0
TC26V = drill 0.813: 1 -1.27,0; 2 1.27,0
SOT23-W = smd 1.2 x 1.4: 1 -1.1,-1.3; 2 1.1,-1.3 | smd 2.8 x 1.4: 3 0,1.3
BUTTON_15MM = smd 1.27 x 0.635: P$1 0,0
BUTTON_10MM = smd 1.27 x 0.635: P$1 0,0
_0805 = smd 1.2 x 1.3: 1 -1.016,0; 2 1.016,0
R1218 = smd 1.05 x 4.9: 1 -1.475,0; 2 1.475,0
M0805 = smd 1.3 x 1.6: 1 -0.95,0; 2 0.95,0
SOLDERJUMPER_ARROW_NOPASTE = smd 0.762 x 1.524: 1 -1.016,0; 2 1.016,0
PS1240P02BT = drill 0.8: P$1 -2.54,0; P$2 2.54,0
1X01_ROUND = drill 1 pad 1.676: 1 0,0
TO252 = smd 1 x 1.6: 1 -2.28,-4.8; 2 2.28,-4.8 | smd 5.4 x 6.2: 3 0,2.5
SOIC8_208MIL = smd 0.6 x 2.2: 1 -1.905,-3.315; 2 -0.635,-3.315; 3 0.635,-3.315; 4 1.905,-3.315; 5 1.905,3.315; 6 0.635,3.315; 7 -0.635,3.315; 8 -1.905,3.315
LQFP100 = smd 0.27 x 1.5: 1 -6,-7.75; 2 -5.5,-7.75; 3 -5,-7.75; 4 -4.5,-7.75; 5 -4,-7.75; 6 -3.5,-7.75; 7 -3,-7.75; 8 -2.5,-7.75; 9 -2,-7.75; 10 -1.5,-7.75; 11 -1,-7.75; 12 -0.5,-7.75; 13 0,-7.75; 14 0.5,-7.75; 15 1,-7.75; 16 1.5,-7.75; 17 2,-7.75; 18 2.5,-7.75; 19 3,-7.75; 20 3.5,-7.75; 21 4,-7.75; 22 4.5,-7.75; 23 5,-7.75; 24 5.5,-7.75; 25 6,-7.75; 51 6,7.75; 52 5.5,7.75; 53 5,7.75; 54 4.5,7.75; 55 4,7.75; 56 3.5,7.75; 57 3,7.75; 58 2.5,7.75; 59 2,7.75; 60 1.5,7.75; 61 1,7.75; 62 0.5,7.75; 63 0,7.75; 64 -0.5,7.75; 65 -1,7.75; 66 -1.5,7.75; 67 -2,7.75; 68 -2.5,7.75; 69 -3,7.75; 70 -3.5,7.75; 71 -4,7.75; 72 -4.5,7.75; 73 -5,7.75; 74 -5.5,7.75; 75 -6,7.75 | smd 1.5 x 0.27: 26 7.75,-6; 27 7.75,-5.5; 28 7.75,-5; 29 7.75,-4.5; 30 7.75,-4; 31 7.75,-3.5; 32 7.75,-3; 33 7.75,-2.5; 34 7.75,-2; 35 7.75,-1.5; 36 7.75,-1; 37 7.75,-0.5; 38 7.75,0; 39 7.75,0.5; 40 7.75,1; 41 7.75,1.5; 42 7.75,2; 43 7.75,2.5; 44 7.75,3; 45 7.75,3.5; 46 7.75,4; 47 7.75,4.5; 48 7.75,5; 49 7.75,5.5; 50 7.75,6; 76 -7.75,6; 77 -7.75,5.5; 78 -7.75,5; 79 -7.75,4.5; 80 -7.75,4; 81 -7.75,3.5; 82 -7.75,3; 83 -7.75,2.5; 84 -7.75,2; 85 -7.75,1.5; 86 -7.75,1; 87 -7.75,0.5; 88 -7.75,0; 89 -7.75,-0.5; 90 -7.75,-1; 91 -7.75,-1.5; 92 -7.75,-2; 93 -7.75,-2.5; 94 -7.75,-3; 95 -7.75,-3.5; 96 -7.75,-4; 97 -7.75,-4.5; 98 -7.75,-5; 99 -7.75,-5.5; 100 -7.75,-6
SOIC8_150MIL = smd 0.6 x 2.2: 1 -1.905,-2.6; 2 -0.635,-2.6; 3 0.635,-2.6; 4 1.905,-2.6; 5 1.905,2.6; 6 0.635,2.6; 7 -0.635,2.6; 8 -1.905,2.6

### Placement (x,y rotation side)
B1  7.94,4.76 180 bottom
B2  125.02,5.08 0 bottom
C1  48.9,66.67 270 bottom
C2  67.94,65.41 270 bottom
C3  49.05,29.37 270 bottom
C4  49.05,24.93 90 bottom
C5  84.93,9.69 180 bottom
C6  84.93,15.72 180 bottom
C7  43.81,66.67 270 bottom
C8  73.03,65.41 270 bottom
C9  99.06,25.4 180 bottom
C10  102.23,64.77 270 bottom
C11  99.69,64.77 270 bottom
C12  78.74,66.67 90 bottom
C13  101.6,56.52 270 bottom
C14  61.43,33.5 90 bottom
C15  71.75,20.95 90 top
C16  79.06,16.83 270 top
C17  64.92,33.5 90 bottom
C18  67.15,33.5 90 bottom
C19  71.94,36.04 90 bottom
C20  75.08,16.04 270 top
C21  73.66,6.35 270 bottom
C22  54.76,18.58 0 bottom
C23  58.89,33.5 90 bottom
C24  80.16,29.68 90 bottom
C25  79.69,10.16 180 bottom
C26  65.09,6.35 270 bottom
C27  57.62,28.73 90 bottom
C28  53.19,34.76 0 bottom
C29  79.06,20.95 270 top
C30  79.06,25.4 270 top
C31  81.6,42.55 90 bottom
C32  84.14,42.55 90 bottom
C33  86.36,42.55 90 bottom
C34  68.72,14.26 0 top
CN1  81.92,6.99 0 bottom
CN2  34.92,67.94 180 bottom
CN3  69.22,43.5 0 top
D1  44.45,72.39 0 bottom
D2  104.78,67.31 90 bottom
JTAG1  30.48,5.71 0 bottom
L1  95.25,71.75 180 bottom
LED1  133.03,5.08 90 bottom
Q1  52.86,27.15 270 bottom
Q2  82.39,12.86 90 bottom
Q3  104.14,5.08 90 bottom
Q4  40.96,27.62 90 bottom
QT1  16.51,60.33 0 top
QT2  121.92,22.23 180 top
QT3  121.92,34.92 0 top
QT4  121.92,60.33 0 top
QT5  16.51,28.57 180 top
R1  34.29,61.59 180 bottom
R2  132.08,10.16 0 bottom
R3  127,10.16 180 bottom
R4  105.41,10.16 90 bottom
R5  99.69,5.4 90 bottom
R6  82.55,66.67 90 bottom
R7  34.92,13.34 90 bottom
R8  37.47,13.34 90 bottom
R9  40.01,13.34 90 bottom
R10  42.55,13.34 90 bottom
R11  45.09,13.34 90 bottom
R12  86.04,66.67 90 bottom
R13  89.53,71.12 270 bottom
R14  40.96,31.11 0 bottom
R15  40.96,23.81 0 bottom
R16  96.52,61.27 270 bottom
R17  92.08,61.27 90 bottom
R18  64.77,16.51 180 top
R19  86.36,18.1 0 top
R20  86.36,20.64 0 top
R21  86.36,23.18 0 top
R22  64.77,14.29 180 top
SJ1  54.29,38.1 270 bottom
SJ2  58.26,9.36 90 bottom
SJ3  61.43,36.98 0 bottom
SJ4  38.57,19.85 180 bottom
SJ5  69.53,6.35 90 bottom
SJ6  61.59,45.09 90 top
SJ7  64.14,45.09 90 top
SJ8  66.67,45.09 90 top
SJ9  69.22,45.09 90 top
SJ10  71.75,45.09 90 top
SJ11  74.3,45.09 90 top
SJ12  76.83,45.09 90 top
SJ13  79.38,45.09 90 top
SJ14  81.92,45.09 90 top
SJ15  84.45,45.09 90 top
SP1  113.03,6.67 180 bottom
TP1  37.47,57.15 0 top
TP2  40.32,57.15 0 top
TP3  4.45,10.16 0 top
TP4  135.57,8.26 0 top
TP5  93.34,55.88 0 top
TP6  90.81,55.88 0 top
U1  59.05,69.22 0 bottom
U2  97.16,29.84 270 bottom
U3  69.37,20.8 180 bottom
U4  94.61,66.67 270 bottom
U$9  [LOGO_MAUA]  116.2,41.59 0 top
U$13  [LOGO_MAUA]  21.91,40.96 0 bottom

### Tracks (layer width: path | path; a pad name or v marks a point on that pad's centre or on a via)
12V
  Bottom 1.016: CN2.2 34.92,70.48 36.83,72.39 D1.A
+3V3  (via drill 0.6)
  Top 0.254: 57.78,61.59 57.78,61.27 | v98.74,27.3 104.46,27.3 v104.78,26.99 | CN3.1 CN3.2 83.93,38.95 v84.14,39.21 | CN3.1 84.43,35.21 84.14,34.92 83.19,34.92 82.93,35.18 CN3.4 82.93,37.28 82.93,38.39 v81.76,39.37 | v85.57,38.89 85.57,38.58 85.32,38.38 84.87,38.36 84.43,38.07 CN3.1
  Top 0.305: 57.2,61.55 58.06,61.32 57.78,61.59
  Top 0.406: v58.42,3.81 v57.31,6.99
  Top 1.016: v59.05,62.55 59.05,62.23 58.42,61.59 57.78,61.59 v37.47,61.59
  Bottom 0.254: SJ5.1 69.53,4.13 68.9,3.49 | TP1.1 35.56,57.15 35.56,20.95 | U2.3 97.16,29.21 | U2.7 95.89,30.48 95.89,31.75 U2.8 92.08,31.75 91.76,32.07 91.76,38.73 91.44,39.05 85.72,39.05 v85.57,38.89 86.36,40.01 C33.1 | 98.11,26.35 v98.74,27.3 | v104.78,26.99 104.78,11.43 105.16,11.43 R4.2 | C32.1 v84.14,39.21 | C31.1 81.6,41.27 81.76,41.12 v81.76,39.37 60.96,39.37 60.42,38.98 SJ3.2
  Bottom 0.305: SJ1.1 55.5,39.12 57.63,36.98 SJ3.2
  Bottom 0.406: JTAG1.1 JTAG1.2 | R11.2 R10.2 R9.2 R8.2 R7.2 34.92,18.41 35.56,19.05 35.56,20.32 | SP1.P$2 115.57,11.43 105.66,11.43 R4.2 | 68.9,3.49 58.74,3.49 v58.42,3.81 | SJ1.1 36.77,39.12 35.56,40.32
  Bottom 0.508: v37.47,61.59 R1.2 | 95.89,30.48 97.16,29.21 97.16,27.3 98.11,26.67 98.11,26.35 C9.1 | R2.2 130.49,10.16 128.59,10.22 R3.2 128.27,10.79 127.64,11.43 115.57,11.43
  Bottom 0.61: U4.6 87,66.04 85.86,65.41 R12.1 | SJ2.1 v57.3,6.98 v57.31,6.99 48.26,6.99 JTAG1.2
  Bottom 0.813: SJ4.1 35.72,19.85 35.56,20 35.56,20.32 35.56,20.95 35.56,40.32 35.56,58.1 37.47,60.01 v37.47,61.59 | R11.2 47.88,14.35 48.26,13.97 48.26,6.99
  Bottom 1.016: 59.05,71.75 U1.3
  other vias: 55.24,73.66 55.24,72.07 55.24,70.48 55.24,68.9 55.24,67.31 62.87,73.66 62.87,72.07 62.87,70.48 62.87,68.9 62.87,67.31 64.77,73.66 64.77,72.07 64.77,70.48 64.77,68.9 64.77,67.31 66.67,73.66 66.67,72.07 66.67,70.48 66.67,68.9 68.58,73.66 68.58,72.07 68.58,70.48 68.58,68.9 70.48,73.66 70.48,72.07 70.48,70.48 70.48,68.9 70.48,67.31 72.39,73.66 72.39,72.07 72.39,70.48 72.39,68.9 74.3,73.66 74.3,72.07 74.3,70.48 74.3,68.9 60.33,73.66 60.33,72.07 60.33,70.48 60.33,68.9 60.33,67.31 57.78,73.66 57.78,72.07 57.78,70.48 57.78,68.9 57.78,67.31
  pour Bottom: 57.78,66.04 54.29,66.04 arc-90 53.98,66.36 53.98,74.93 arc-90 54.29,75.25 75.25,75.25 arc-90 75.56,74.93 75.56,66.04 arc-90 75.25,65.72 60.33,65.72 arc90 60.01,65.41 60.01,62.23 arc-90 59.69,61.91 58.42,61.91 arc-90 58.1,62.23 58.1,65.72 arc90
  pour Bottom: 57.78,66.04 54.29,66.04 arc-90 53.98,66.36 53.98,74.93 arc-90 54.29,75.25 75.25,75.25 arc-90 75.56,74.93 75.56,66.04 arc-90 75.25,65.72 60.33,65.72 arc90 60.01,65.41 60.01,62.23 arc-90 59.69,61.91 58.42,61.91 arc-90 58.1,62.23 58.1,65.72 arc90
  pour Top: 57.78,66.04 54.29,66.04 arc-90 53.98,66.36 53.98,74.93 arc-90 54.29,75.25 75.25,75.25 arc-90 75.56,74.93 75.56,66.04 arc-90 75.25,65.72 60.33,65.72 arc90 60.01,65.41 60.01,62.23 arc-90 59.69,61.91 58.42,61.91 arc-90 58.1,62.23 58.1,65.72 arc90
  pour Bottom (isolate 0.254): 76.83,66.67 93.34,66.67 93.66,66.36 93.66,65.72 93.34,65.41 89.85,65.41 89.22,64.77 89.22,59.37 74.93,59.37 74.93,65.72 75.56,64.77 75.56,74.93 76.83,74.93
+5V
  Bottom 0.813: U1.2 52.42,64.42 52.07,64.77 52.07,67.31 51.44,67.94 C1.+
  Bottom 1.016: D1.C 48.9,70.48 C1.+ 48.69,68.26 44.45,68.26 C7.1
ADVREF
  Bottom 0.254: U3.1 63.37,29.98 61.91,31.43 61.91,32.4 C14.1
  Bottom 0.305: C14.1 62.4,32.55 62.87,33.02 62.87,36.45 SJ3.1
GND  (via drill 0.6)
  Top 0.254: 63.5,38.42 63.43,38.34 CN3.43 63.43,34.72 | CN3.48 60.93,38.07 61.28,38.42 | CN3.25 72.43,38.06 | CN3.35 67.43,38.52 67,38.94 66.93,38.86 CN3.36 66.93,36.67 | CN3.34 67.93,36.75 | 67.93,36.75 67.93,38.6 67.92,38.61 67.92,38.73 68.15,38.96 68.43,38.69 CN3.33 | 69.93,37.26 69.93,38.35 | 70.43,37.26 70.43,38.35 | 70.92,37.26 70.92,38.35 | 71.42,37.26 71.42,38.35 | 68.94,37.29 68.94,38.38 | 71.91,37.26 71.91,38.35 | 72.92,37.26 72.92,38.35 | 69.42,37.36 69.44,37.39 69.44,38.58 | 67.92,37.36 67.92,38.56 | 67.44,37.01 67.44,38.2 | 66.93,37.01 66.93,38.2 | 66.42,37.03 66.42,38.23 | 65.91,37.01 65.91,38.2 | 68.26,38.58 68.42,38.42 68.42,36.67 68,36.67 67.93,36.75 | 60.93,34.82 60.93,36.24 | 67.93,35.38 CN3.34 | 68.43,35.69 CN3.33 | CN3.33 68.43,36.83 | 69.93,35.41 69.93,36.5 | 70.43,35.41 70.43,36.5 | 70.92,35.41 70.92,36.5 | 71.42,35.41 71.42,36.5 | 68.91,35.53 68.91,36.52 68.93,36.54 CN3.32 | 69.42,35.51 69.44,35.53 69.44,36.73 69.43,36.71 CN3.31 | 67.92,35.51 CN3.34 | 68.45,36.07 68.42,36.56 CN3.33 | 67.44,35.33 67.44,36.52 | 66.93,35.53 66.93,36.67 | 66.93,36.67 66.93,36.73 | 66.42,35.51 66.42,36.7 66.43,36.7 CN3.37 66.43,38.6 66.29,38.73 65.93,38.37 CN3.38 65.94,36.66 | 65.94,35.48 65.94,36.66 | 71.93,35.41 71.93,36.5 | 72.42,35.41 72.42,36.5 | 72.92,35.59 72.92,36.45 72.93,36.45 CN3.24 | 67.92,36.7 CN3.34 | CN3.34 | 65.94,36.68 65.94,36.66 | 81.92,38.1 82.43,37.59 CN3.5 82.43,34.1 82.55,33.97 83.19,33.97 | 83.03,39.85 83.43,38.49 CN3.3 83.43,35.64 83.5,35.56
  Bottom 0.254: U3.26 78.24,26.8 78.74,27.3 78.74,30.48 78.89,30.63 C24.2 | 64.14,30.16 63.87,29.9 63.87,28.68 U3.2 63.87,27.33 | 75.88,26.8 77,26.8
  Bottom 0.305: U3.70 65.87,14.78 | U3.95 63.33,24.3 63.5,24.77 | 75.56,17.14 75.72,17.3 U3.45 78.39,17.3 | 65.86,11.38 65.86,13.11
  Bottom 0.508: B1.4 19.59,7.08 JTAG1.20
  Bottom 0.61: JTAG1.20 JTAG1.18 JTAG1.16 JTAG1.14 JTAG1.12 JTAG1.10 JTAG1.8 JTAG1.6 JTAG1.4 | B1.3 B1.4 | C4.2 C3.2
  Bottom 0.813: B2.3 B2.4
  other vias: 105.41,74.61 107.31,74.61 111.12,74.61 109.22,74.61 27.3,74.61 29.21,74.61 31.11,74.61 33.02,74.61 1.59,10.79 1.59,12.7 1.59,14.61 1.59,16.51 136.84,10.79 136.84,12.7 136.84,14.61 136.84,16.51 63.5,24.13 66.67,23.5 69.22,24.13 69.22,21.59 66.67,21.59 66.67,19.05 71.48,26.43 69.22,19.05 71.12,24.13 1.59,2.54 1.59,6.99 40.01,63.82 40.01,67.63 40.01,70.17 37.47,63.82 34.29,63.82 51.44,72.71 77.15,13.02 60.96,12.38 95.57,25.08 61.91,5.08 65.09,9.53 51.75,18.73 43.81,18.73 47.94,17.78 56.2,35.88 57.78,40.32 47.31,35.88 52.07,27.3 46.35,27.3 46.35,30.8 48.9,32.38 48.9,21.91 46.35,23.18 39.69,53.66 44.77,53.66 49.85,53.66 54.93,53.66 62.55,53.66 67.63,53.66 72.71,53.66 77.79,53.66 82.87,53.66 87.95,53.66 93.03,53.66 98.11,53.66 39.69,48.58 44.77,48.58 49.85,48.58 54.93,48.58 39.69,43.5 44.77,43.5 49.85,43.5 54.93,43.5 62.55,48.58 67.63,48.58 72.71,48.58 77.79,48.58 82.87,48.58 87.95,48.58 93.03,48.58 98.11,48.58 90.49,43.5 95.57,43.5 100.65,43.5 105.73,43.5 51.66,8.92 51.66,5.02 48.89,4.9 101.55,14.18 98.06,14.18 94.7,14.18 91.1,14.12 85.72,12.82 88.37,36.65 88.58,31.27 96.02,37.66 100.7,37.46 105.08,37.51 69.74,38.45 67.31,38.48 64.66,38.47 66.55,26.64 74.3,23.91 71.41,14.93
  pour Top: 46.35,32.89 54.74,32.89 55.24,32.38 55.24,21.59 46.99,21.59 46.35,22.23
  pour Top (rank 5): -1.27,78.11 140.34,78.11 140.34,-3.17 -1.27,-3.17
  pour Bottom (rank 4): -1.91,76.83 139.06,76.83 139.06,-0.64 -1.91,-0.64
N$1
  Bottom 0.406: Q4.1 39.66,24.1 R15.2
  cutout Top: 2.54,73.66 30.48,73.66 30.48,17.14 63.18,17.14 62.55,17.46 64.45,17.46 64.77,17.14 64.77,13.34 2.54,13.34
  cutout Top: 107.95,73.66 135.89,73.66 135.89,13.34 107.95,13.34 107.95,17.14 86.36,17.14 86.36,24.13 107.95,24.13
  cutout Bottom: 107.95,73.66 135.89,73.66 135.89,13.34 107.95,13.34
  cutout Bottom: 2.54,73.66 30.48,73.66 30.48,13.34 2.54,13.34
N$2
  Bottom 0.406: R14.1 41.97,27.91 Q4.3
N$3
  Bottom 0.254: U3.77 58.92,15.3 58.26,14.64 SJ2.2
N$4
  Top 0.254: CN3.14 77.93,42.05 78.11,42.23 84.3,42.23 84.45,42.39 SJ15.1
N$7  (via drill 0.6)
  Top 0.305: v45.09,9.53 45.09,8.89 44.45,8.26 38.73,8.26 38.1,7.62 38.1,5.71 JTAG1.3
  Bottom 0.406: v45.09,9.53 R11.1
N$8
  Top 0.254: R19.2 116.2,18.1 119.06,20.95 120.65,20.95 QT2.P$1
N$10
  Top 0.254: R20.2 111.76,20.64 114.94,23.81 114.94,27.94 QT3.P$1
N$12
  Top 0.254: QT4.P$1 121.92,56.2 119.06,53.66 113.03,47.62 113.03,26.04 110.17,23.18 R21.2
N$14
  Bottom 0.508: R2.1 133.1,6.73 LED1.A
N$16
  Top 0.254: R22.2 63.18,14.29 62.87,14.61 26.99,14.61 20,21.59 QT5.P$1
N$22
  Bottom 0.254: U3.87 40.3,20.3 39.37,19.37 39.37,20.07 SJ4.2
N$26
  Bottom 0.406: Q3.1 100.8,3.98 100.33,4.45 100.27,4.38 R5.1
N$27
  Bottom 0.406: R4.1 105.44,9.11 Q3.3 107.31,5.08 109.22,6.67 SP1.P$1
N$30
  Bottom 0.254: U3.61 70.37,10.04 69.53,9.21 SJ5.2
N$49
  Bottom 0.61: U4.8 90.81,68.58 89.53,69.85 R13.2
N$50
  Bottom 0.406: R6.2 86.04,69.22 86.04,69.85
  Bottom 0.61: U4.7 87.63,67.31 87,67.94 84.58,67.94 R12.2
  Bottom 1.016: R12.2 86.04,69.85 86.04,71.44 86.68,72.07 R13.1 92.39,72.07 L1.1
N$51
  Bottom 0.61: U4.5 92.02,62.92 R17.2 R16.1
  pour Bottom (isolate 0.254): 90.17,65.09 93.98,65.09 94.3,64.77 94.3,63.82 94.61,63.5 97.79,63.5 98.11,63.18 98.11,61.91 97.79,61.59 90.81,61.59 90.17,62.23
N$52
  pour Bottom (isolate 0.254): 95.57,68.26 95.89,67.94 105.41,67.94 106.05,68.58 106.05,72.39 105.41,73.03 96.2,73.03 95.57,72.39
N$53
  Bottom 0.254: 99.06,66.04 C11.1
  Bottom 0.406: C10.1 99.69,66.04 C11.1
  Bottom 0.61: U4.3 99.06,66.04 99.38,66.04
N$59
  Top 0.254: R18.2 63.18,16.51 62.87,16.19 30.16,16.19 28.89,17.46 28.89,47.94 QT1.P$1
NRST  (via drill 0.6)
  Top 0.406: JTAG1.15 25.4,5.71 25.4,8.89 26.04,9.53 v26.67,9.53
  Bottom 0.254: 70.48,2.22 70.8,2.22 71.75,3.17
  Bottom 0.305: U3.60 70.87,9.14 71.75,8.26 71.75,3.17 | 70.48,2.22 25.4,2.22 24.13,3.17
  Bottom 0.406: v26.67,9.53 34.29,9.53 34.92,10.16 R7.1
  Bottom 0.508: B1.2 12.16,2.44 | 24.13,3.17 JTAG1.15
  Bottom 0.61: B1.2 B1.1 | 12.16,2.44 23.4,2.44 24.13,3.17
PA0  (via drill 0.6)
  Top 0.305: v59.69,5.4 59.69,3.81 60.01,3.49 119.7,3.49 121.28,5.08 v130.81,5.08
  Bottom 0.305: U3.74 63.87,11.16 59.69,6.99 v59.69,5.4 | LED1.C 131.86,4.03 v130.81,5.08
PA1  (via drill 0.6)
  Top 0.305: v96.2,5.4 68.9,5.4 67.31,6.99 v62.55,6.99
  Bottom 0.305: v62.55,6.99 62.55,8.57 64.87,10.89 U3.72
  Bottom 0.406: R5.2 97.85,6.41 96.84,5.4 v96.2,5.4
PA2  (via drill 0.6)
  Top 0.305: v67.31,5.71 67.31,5.4 68.26,4.45 117.79,4.45
  Top 0.406: 117.79,4.45 118.87,4.45 B2.2
  Bottom 0.305: U3.67 67.37,6.09 v67.31,5.71 | B2.2 121.19,7.08 120.97,6.67
  Bottom 0.406: R3.1 126.05,7.3 B2.1
  Bottom 0.813: B2.1 B2.2
PA4  (via drill 0.6)
  Top 0.61: v32.38,12.06 18.41,12.06 15.24,8.89 15.24,3.17 16.51,1.91 74.61,1.91 v74.93,2.22
  Bottom 0.254: U3.55 73.37,10.13 75.25,8.26 75.25,2.54 v74.93,2.22 | 32.7,61.34 R1.1
  Bottom 0.61: CN2.1 32.38,61.85 R1.1
  Bottom 0.813: v32.38,12.06 32.38,60.71 R1.1
PA5
  Bottom 0.254: U3.53 74.37,10.72 78.11,6.99 CN1.2
PA6
  Bottom 0.254: U3.52 74.87,10.86 77.15,8.57 81.6,8.57 81.92,8.26 CN1.1
PA11
  Bottom 0.254: U3.42 102.62,18.8 102.87,19.05 102.87,31.43 102.55,31.75 U2.1
PA12  (via drill 0.6)
  Top 0.254: CN3.12 78.93,41.14 79.06,41.27 92.87,41.27 93.03,41.12 v93.03,33.02
  Bottom 0.254: U3.41 101.85,19.3 102.23,19.68 102.23,30.16 101.92,30.48 U2.2 98.42,30.48 95.89,33.02 v93.03,33.02
PA13  (via drill 0.6)
  Top 0.254: CN3.13 78.43,41.6 78.58,41.75 94.14,41.75 94.3,41.59 94.3,27.3 v93.66,26.04
  Bottom 0.254: U3.33 84.26,23.3 84.45,23.51 84.45,23.5 88.9,27.94 91.76,27.94 | 91.76,27.94 U2.5 | v93.66,26.04 91.76,26.99 91.76,27.94
PA14  (via drill 0.6)
  Top 0.254: CN3.11 79.43,40.69 79.53,40.8 91.44,40.8 91.6,40.64 91.6,30.96 v91.76,30.8
  Bottom 0.254: v91.76,30.8 91.76,29.69 91.92,29.53 | U2.6 92.23,29.21 91.92,29.53 | U3.31 81.77,24.3 83.82,26.35 83.87,26.39 87.06,29.53 91.92,29.53
PA15  (via drill 0.6)
  Top 0.254: v81.92,28.26 81.92,32.7 81.93,32.71 CN3.6
  Bottom 0.254: U3.30 81.32,24.8 82.13,25.59 82.13,27.97 v81.92,28.26
PA17  (via drill 0.6)
  Top 0.254: SJ6.1 61.59,40.96 61.75,40.8 73.34,40.8 73.43,40.72 CN3.23 73.43,35.38 72.73,34.66 69.08,34.66 68.9,34.45 v68.9,34.29
  Bottom 0.254: v68.9,34.29 68.89,34.14 68.89,34.3 v68.9,34.29 | U3.12 68.87,32.22 68.72,32.38 68.72,33.97 v68.9,34.29
PA18  (via drill 0.6)
  Top 0.254: SJ7.1 64.14,41.43 64.29,41.27 73.82,41.27 73.93,41.17 CN3.22 73.93,35.22 72.89,34.16 70.19,34.16 69.94,34.16 69.7,33.92 v69.69,33.34
  Bottom 0.254: U3.14 69.87,33.18 v69.69,33.34
PA19  (via drill 0.6)
  Top 0.254: SJ8.1 66.67,41.91 66.83,41.75 74.3,41.75 74.43,41.62 CN3.21 74.43,35.06 v72.73,33.31
  Bottom 0.254: U3.18 71.87,31.86 72.44,32.43 72.44,32.88 v72.73,33.31
PA20  (via drill 0.6)
  Top 0.254: SJ9.1 69.22,42.39 69.37,42.23 74.77,42.23 74.93,42.07 CN3.20 74.93,34.29 v74.59,33.95
  Bottom 0.254: v74.59,33.95 74.59,33.73 74.6,33.58 74.92,33.35 75.68,32.81 75.68,30.36 74.88,29.82 U3.24
PA21  (via drill 0.6)
  Top 0.254: SJ10.1 71.75,42.86 71.91,42.7 75.25,42.7 75.43,42.52 CN3.19 75.43,33.2 75.25,33.02 73.7,33.02 73.15,32.47 71.85,32.48 v71.01,33.31
  Bottom 0.254: U3.15 70.37,32.74 v71.01,33.31
PA22  (via drill 0.6)
  Top 0.254: SJ11.1 74.3,43.34 74.45,43.18 75.72,43.18 75.93,42.98 CN3.18 75.93,32.64 75.72,32.44 73.87,32.44 v73.03,31.59
  Bottom 0.254: U3.20 72.87,31.43 v73.03,31.59
PA23  (via drill 0.6)
  Top 0.254: SJ12.1 76.83,43.66 76.43,43.41 CN3.17 76.43,31.82 76.2,31.59 v74.3,31.59
  Bottom 0.254: U3.22 73.87,31.32 v74.3,31.59
PA24  (via drill 0.6)
  Top 0.254: SJ13.1 79.38,43.34 79.22,43.18 77.15,43.18 76.93,42.95 CN3.16 76.93,32.79 77.15,32.54 v77.47,32.54 | v75.56,22.86 75.56,26.86 v76.36,27.73
  Bottom 0.254: U3.34 75.62,22.8 v75.56,22.86 | v76.36,27.73 76.36,28.02 77.01,28.68 77.01,32 v77.47,32.54
PA25  (via drill 0.6)
  Top 0.254: SJ14.1 81.92,42.86 81.76,42.7 77.63,42.7 77.43,42.5 CN3.15 77.43,33.77 77.63,33.5 v78.58,33.5 | v77.79,27.94 77.79,27.62 76.52,26.67 76.52,22.54 75.25,21.27 v75.25,20.64
  Bottom 0.254: v78.58,33.5 78.59,31.68 77.8,30.88 v77.79,27.94 | 75.56,20.64 v75.25,20.64 75.41,20.8 U3.38
PB4  (via drill 0.6)
  Top 0.254: v42.55,10.16 42.55,10.48 42.86,10.79 | v76.52,10.79 76.52,9.84 76.2,9.53
  Top 0.305: 42.86,10.79 53.34,10.79 55.88,8.26 74.93,8.26 76.2,9.53 | JTAG1.5 35.56,5.71 35.56,8.26 36.2,8.89 41.91,8.89 42.55,9.53 v42.55,10.16
  Bottom 0.305: U3.51 75.37,12.19 76.2,11.43 76.52,11.11 v76.52,10.79
  Bottom 0.406: v42.55,10.16 R10.1
PB5
  Bottom 0.305: JTAG1.13 26.67,3.49 27.3,2.86 56.52,3.02 56.52,4.13 57.15,4.76 58.42,4.76 58.74,5.08 58.74,6.99 59.69,7.94 59.69,14.29 60.2,14.8 U3.76
PB6  (via drill 0.6)
  Top 0.254: v40.01,10.16 40.01,11.11 40.32,11.43 55.4,11.43 v55.88,11.91
  Top 0.305: JTAG1.7 33.02,5.71 33.02,8.26 34.29,8.26 35.56,9.53 39.37,9.53 v40.01,10.16
  Bottom 0.254: U3.79 56.62,16.3 55.88,15.56
  Bottom 0.305: v55.88,11.91 55.88,15.56
  Bottom 0.406: v40.01,10.16 R9.1
PB7  (via drill 0.6)
  Top 0.254: v37.47,10.79 37.47,12.06 37.78,12.38 v54.29,12.38
  Top 0.305: JTAG1.9 30.48,5.71 30.48,8.26 31.11,8.89 31.43,8.89 32.7,10.16 36.83,10.16 v37.47,10.79
  Bottom 0.254: U3.83 59.58,18.3 58.42,17.14 54.93,17.14 54.29,16.51 v54.29,12.38
  Bottom 0.406: JTAG1.11 JTAG1.9 | v37.47,10.79 R8.1
PB10  (via drill 0.6)
  Top 0.254: CN3.7 81.43,29.2 81.12,28.89 77.15,28.89 76.83,28.57 75.88,28.57 75.56,28.26 62.71,28.26 62.55,28.1 62.55,21.75 62.87,21.43 v63.5,21.43
  Bottom 0.254: v63.5,21.43 63.5,21.27 | U3.88 62.87,20.8 63.02,20.8 63.49,21.11 63.5,21.27 | 63.5,21.27 63.49,21.28
PB11  (via drill 0.6)
  Top 0.254: CN3.8 80.93,29.65 80.64,29.37 76.99,29.37 76.68,29.05 75.72,29.05 75.41,28.73 61.59,28.73 61.44,28.57 61.44,21.38 61.28,21.22 v59.05,21.22
  Bottom 0.254: U3.89 59.4,21.3 v59.05,21.22
PB13  (via drill 0.6)
  Top 0.254: CN3.9 80.43,30.1 80.17,29.84 76.83,29.84 76.52,29.53 75.56,29.53 75.25,29.21 61.12,29.21 60.96,29.05 60.96,23.58 60.77,23.44 v59.32,23.44
  Bottom 0.254: U3.93 59.5,23.3 v59.32,23.44
PB14  (via drill 0.6)
  Top 0.254: CN3.10 79.93,30.55 79.69,30.32 76.68,30.32 76.36,30 75.41,30 75.09,29.69 60.64,29.69 60.48,29.53 60.48,26.83 60.33,26.67 v59.37,26.67
  Bottom 0.254: U3.99 59.74,26.3 v59.37,26.67
PC0  (via drill 0.6)
  Top 0.254: C15.2 72.38,22.37 72.39,23.5 72.39,25.92 v73.18,26.71
  Bottom 0.254: U3.25 75.37,27.43 74.93,26.99 73.47,26.99 v73.18,26.71
PC1  (via drill 0.6)
  Top 0.254: 72.36,19.39 71.82,19.82 C15.1 | C15.1 72.39,20.64 | R18.1 71.76,16.53 v72.37,17.14 72.36,19.39 | 72.36,19.39 C15.1
  Bottom 0.254: U3.47 75.77,16.3 75.25,16.83 72.69,16.83 v72.37,17.14
PC2  (via drill 0.6)
  Top 0.254: C16.2 81.28,15.88 81.92,16.19 v81.92,16.51
  Bottom 0.254: U3.43 81.71,18.3 81.92,18.1 v81.92,16.51
PC3  (via drill 0.6)
  Top 0.254: 79.38,18.1 79.06,18.1 C16.1 79.38,18.1 | 82.23,18.1 82.55,18.41 v82.55,20.32 | R19.1 82.23,18.1 | 82.23,18.1 79.38,18.1
  Bottom 0.254: U3.40 82.35,19.8 82.55,20 v82.55,20.32
PC4  (via drill 0.6)
  Top 0.254: v81.28,20.95 81.28,20.32 80.96,20 80.01,20 C29.2
  Bottom 0.254: U3.37 79.03,21.3 79.38,20.95 v81.28,20.95
PC5  (via drill 0.6)
  Top 0.254: C29.1 79.58,22.21 79.38,22.23 79.54,22.39 v82.87,22.39 84.62,20.64 R20.1
  Bottom 0.254: U3.35 82.58,22.3 v82.87,22.39
PC6  (via drill 0.6)
  Top 0.254: v83.5,24.45 82.87,24.45 C30.2
  Bottom 0.254: U3.32 82.86,23.8 v83.5,24.45
PC7  (via drill 0.6)
  Top 0.254: v80.96,26.35 C30.1 78.99,26.41 84.71,26.41 85.09,26.04 85.09,23.5 R21.1
  Bottom 0.254: U3.29 80.55,25.3 80.96,25.72 v80.96,26.35
PC8  (via drill 0.6)
  Top 0.254: v71.75,10.16 71.77,12.82 71.45,13.13 C34.2
  Bottom 0.254: U3.58 71.87,10.68 v71.75,10.16
PC9  (via drill 0.6)
  Top 0.254: v68.58,10.16 68.58,12.7 C34.1 R22.1
  Bottom 0.254: U3.62 69.87,10.81 69.22,10.16 v68.58,10.16
PC12  (via drill 0.6)
  Top 0.254: SJ15.2 84.81,46.57 v84.81,48.6
  Bottom 0.254: U3.23 74.39,28.55 74.39,30.4 75.15,30.91 75.15,32.14 74.67,32.62 73.93,32.62 73.72,32.83 73.72,34.44 73.84,34.56 73.85,34.57 74.56,35.28 79.69,35.28 82.69,38.28 82.69,40.31 82.86,40.48 82.86,46.34 84.46,48.61 v84.81,48.6
PC18  (via drill 0.6)
  Top 0.254: v49.85,18.73 46.67,18.73 44.13,21.27
  Top 0.406: v43.81,22.86 43.81,21.59 44.13,21.27
  Bottom 0.254: U3.78 58.03,15.8 57.15,14.92 57.15,11.75 56.2,10.79 53.02,10.79 51.75,12.06 51.75,16.83 v49.85,18.73
  Bottom 0.406: R15.1 42.86,23.81 v43.81,22.86
PC22  (via drill 0.6)
  Top 0.254: v57.63,19.37 57.78,19.37 58.1,19.53 58.1,30 58.26,30.16 65.09,30.16 65.43,30.5 CN3.39
  Bottom 0.254: U3.86 58.7,19.8 58.26,19.37 v57.63,19.37
PC23  (via drill 0.6)
  Top 0.254: v57.15,21.62 57.31,21.75 57.63,22.07 57.63,30.48 57.78,30.64 64.77,30.64 64.93,30.8 CN3.40
  Bottom 0.254: U3.90 60.43,21.8 59.74,22.1 57.68,22.1 v57.15,21.62
PC24  (via drill 0.6)
  Top 0.254: CN3.41 64.43,31.25 64.29,31.11 57.15,31.11 56.99,30.96 56.99,22.86 56.67,22.54 v56.04,22.54
  Bottom 0.254: U3.92 60.2,22.8 59.92,22.55 v56.03,22.55 56.5,22.54 56.2,22.54 v56.04,22.54
PC25  (via drill 0.6)
  Top 0.254: CN3.42 63.93,31.7 63.82,31.59 56.83,31.59 56.52,31.27 56.52,24.13 56.36,23.97 v56.06,23.92
  Bottom 0.254: U3.94 60.34,23.8 59.85,24.29 56.36,24.29 v56.06,23.92
V+  (via drill 0.6)
  Top 0.254: CN3.50 59.93,38.42 59.85,38.42
  Top 0.406: v95.25,58.42 94.61,57.78 91.44,57.78 90.81,57.15 TP6.1 61.59,55.88 59.85,54.13 59.85,38.42
  Bottom 0.61: R16.2 100.85,60.33 | D2.C 104.78,61.59 103.5,60.33 102.98,58.42
  other vias: 98.42,59.05 99.69,60.96 102.23,60.96 104.14,58.42 104.78,60.96
  pour Bottom (isolate 0.254): 95.25,60.96 97.79,60.96 98.74,61.91 102.87,61.91 103.5,62.55 103.5,64.77 103.82,65.41 105.73,65.41 106.05,65.09 106.05,58.42 103.82,56.52 95.25,56.52 94.61,57.15 94.61,60.33
  pour Top (isolate 0.254): 95.25,60.96 97.79,60.96 98.74,61.91 102.87,61.91 103.5,62.55 103.5,64.77 103.82,65.41 105.73,65.41 106.05,65.09 106.05,58.42 103.82,56.52 95.25,56.52 94.61,57.15 94.61,60.33
VBL_K  (via drill 0.6)
  Top 0.254: CN3.49 60.43,32.17 60.33,32.07 56.2,32.07 54.93,33.34 v40.64,33.34
  Bottom 0.254: v40.64,33.34 40.01,33.34
  Bottom 0.406: R14.2 39.94,33.27 40.01,33.34
VCCIO
  Bottom 0.254: 64.68,24.93 64.53,25.01 63.74,25.8 63.24,25.8 U3.98 58.65,25.8 58.42,26.04 58.42,26.67 58.42,26.83 C27.1 | 67.87,25.96 67.87,26.04 U3.10 67.87,30.87 67.63,31.11 65.72,31.11 65.09,31.75 65.09,32.39 C17.1 | U3.91 64.78,22.3 64.67,22.45 64.85,22.23 | U3.69 66.37,15.55 66.36,15.53 | 74.61,15.88 75.69,14.8 U3.50 77.91,14.8 78.74,13.97 78.74,9.85 C25.1 | U3.27 75.65,26.3 75.02,25.16
  Bottom 0.305: C26.1 65.41,7.94 66.37,8.9 U3.69 | U3.27 79.43,26.3 79.69,26.67 79.69,28.26 C24.1 | SJ1.2 54.29,34.92 C28.1 54.14,32.86 56.2,31.11 56.2,28.26 56.52,27.94 57.47,27.94 C27.1
  Bottom 0.406: 75.02,25.16 68.63,25.16 67.87,26.04 66.96,24.92 64.68,24.93 64.67,24.91 64.67,22.45 65.09,22.04 65.09,16.19 65.41,15.88 66.04,15.88 66.36,15.56 66.67,15.88 | 74.61,15.88 66.67,15.88 | 66.67,15.88 66.67,15.85 66.37,15.55
VDDOUT  (via drill 0.6)
  Top 0.254: C20.1 75.08,18.26 v74.93,18.41
  Top 0.406: 69.08,26.99 68.45,27.62 65.91,27.63 v65.06,26.46 65.08,25.8 65.09,25.4 65.09,19.37 64.77,19.05 v63.98,19.05 | v69.05,26.67 69.08,26.99 | 69.08,26.99 69.58,27.62 73.98,27.62 74.3,27.3 74.3,26.04 73.34,25.08 73.34,22.54 v73.73,21.91 73.71,15.24 73.4,14.92 v73.03,14.92
  Bottom 0.254: C21.1 73.03,6.99 72.87,7.14 U3.56 72.87,14.45 v73.03,14.92 | U3.36 74.08,21.8 | v65.06,26.46 64.63,26.8 U3.100 60.51,26.8 59.69,27.62 59.69,31.76 C23.1 | v73.73,21.91 73.66,21.91 74.08,21.8 | v63.98,19.05 63.43,19.3 U3.85 59.62,19.3 59.05,18.73 | 59.05,18.73 58.74,18.41 56.52,18.41 56.03,18.25 C22.1 | 59.05,18.73 59.37,19.05 | C19.1 72.07,35.57 72.05,34.75 71.86,34.51 71.86,33.86 71.86,32.63 71.76,32.53 71.3,32.08 70.87,31.66 U3.16 70.87,27.05 70.48,26.67 v69.05,26.67 68.58,26.67 68.37,26.88 U3.11 68.37,31.96 68.26,32.07 67.63,32.07 C18.1 | 74.08,21.8 73.87,21.8 73.66,21.59 73.66,19.05 | v74.93,18.41 73.66,19.05 | 73.66,19.05 73.72,19.05
XIN
  Bottom 0.254: U3.97 55.98,25.3 55.34,25.94
  Bottom 0.305: 55.34,25.94 55.24,26.04 52.9,28.57 Q1.1
  Bottom 0.61: C3.1 52.1,30.32 Q1.1
XIN32
  Bottom 0.254: C5.1 Q2.1 81.75,11.59 80.01,13.34 80.01,13.97 78.68,15.3 U3.49
XOUT
  Bottom 0.254: U3.96 55.64,24.8
  Bottom 0.305: 55.64,24.8 52.92,24.8 Q1.2
  Bottom 0.61: C4.1 52.1,23.98 Q1.2
XOUT32
  Bottom 0.254: C6.1 Q2.2 81.12,14.13 79.45,15.8 U3.48

### Text on the board
tNames: IMT / INVENSYS | Rev. 2.0
bNames: Rx | Tx